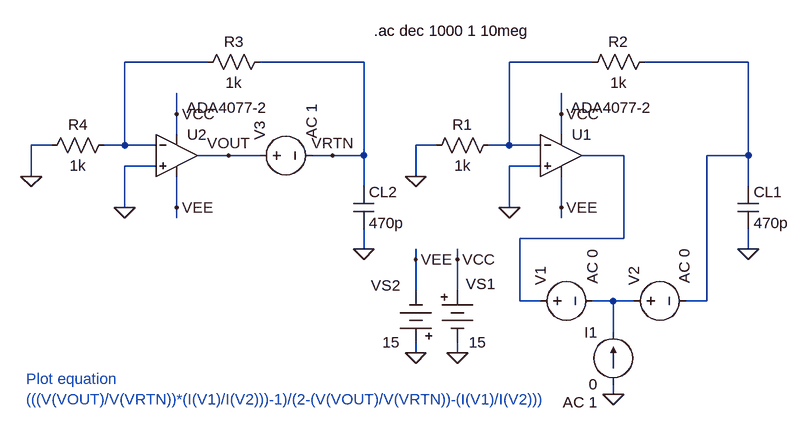
[diagram p0: schematic fig-03-01-31.asc]
fig-03-01-31.asc, the LTspice schematic file:
Version 4
SHEET 1 964 680
WIRE -336 32 -464 32
WIRE -96 32 -256 32
WIRE 256 32 128 32
WIRE 496 32 336 32
WIRE -384 112 -384 80
WIRE 208 112 208 80
WIRE -384 144 -384 112
WIRE 208 144 208 112
WIRE -576 160 -608 160
WIRE -464 160 -464 32
WIRE -464 160 -496 160
WIRE -416 160 -464 160
WIRE 16 160 -16 160
WIRE 128 160 128 32
WIRE 128 160 96 160
WIRE 176 160 128 160
WIRE -304 176 -352 176
WIRE -256 176 -304 176
WIRE -144 176 -176 176
WIRE -96 176 -96 32
WIRE -96 176 -144 176
WIRE 304 176 240 176
WIRE 496 176 496 32
WIRE 496 176 432 176
WIRE -416 192 -464 192
WIRE 176 192 128 192
WIRE -608 208 -608 160
WIRE -16 208 -16 160
WIRE -96 224 -96 176
WIRE 496 224 496 176
WIRE -464 256 -464 192
WIRE -384 256 -384 208
WIRE 128 256 128 192
WIRE 208 256 208 208
WIRE -384 272 -384 256
WIRE 208 272 208 256
WIRE 304 304 304 176
WIRE 304 304 144 304
WIRE -96 320 -96 288
WIRE 496 320 496 288
WIRE -16 336 -16 320
WIRE 48 336 48 320
WIRE -16 384 -16 336
WIRE 48 384 48 336
WIRE 144 400 144 304
WIRE 176 400 144 400
WIRE 288 400 256 400
WIRE 320 400 288 400
WIRE 432 400 432 176
WIRE 432 400 400 400
WIRE 288 448 288 400
WIRE -16 480 -16 464
WIRE 48 480 48 464
WIRE 288 544 288 528
FLAG 128 256 0
FLAG -16 208 0
FLAG -16 480 0
FLAG 48 480 0
FLAG -16 336 VEE
FLAG 48 336 VCC
FLAG 208 112 VCC
FLAG 208 256 VEE
FLAG 496 320 0
FLAG 288 544 0
FLAG -464 256 0
FLAG -608 208 0
FLAG -384 112 VCC
FLAG -384 256 VEE
FLAG -96 320 0
FLAG -304 176 VOUT
FLAG -144 176 VRTN
SYMBOL res 352 16 R90
WINDOW 0 0 56 VBottom 2
WINDOW 3 32 56 VTop 2
SYMATTR InstName R2
SYMATTR Value 1k
SYMBOL Misc\\battery 48 368 R0
WINDOW 0 13 6 Left 2
WINDOW 3 18 96 Left 2
SYMATTR InstName VS1
SYMATTR Value 15
SYMBOL Misc\\battery -16 480 R180
WINDOW 0 24 104 Left 2
WINDOW 3 24 16 Left 2
SYMATTR InstName VS2
SYMATTR Value 15
SYMBOL Opamps\\ADA4077-2 208 112 R0
WINDOW 3 15 -10 Left 2
SYMATTR InstName U1
SYMBOL res 112 144 R90
WINDOW 0 0 56 VBottom 2
WINDOW 3 32 56 VTop 2
SYMATTR InstName R1
SYMATTR Value 1k
SYMBOL cap 480 224 R0
SYMATTR InstName CL1
SYMATTR Value 470p
SYMBOL voltage 160 400 R270
WINDOW 123 26 96 Left 2
WINDOW 39 0 0 Left 0
SYMATTR Value2 AC 0
SYMATTR InstName V1
SYMATTR Value ""
SYMBOL voltage 304 400 R270
WINDOW 123 27 94 Left 2
WINDOW 39 0 0 Left 0
SYMATTR Value2 AC 0
SYMATTR InstName V2
SYMATTR Value ""
SYMBOL current 288 528 R180
WINDOW 0 24 80 Left 2
WINDOW 3 24 0 Left 2
WINDOW 123 24 -28 Left 2
WINDOW 39 0 0 Left 0
SYMATTR InstName I1
SYMATTR Value 0
SYMATTR Value2 AC 1
SYMBOL res -240 16 R90
WINDOW 0 0 56 VBottom 2
WINDOW 3 32 56 VTop 2
SYMATTR InstName R3
SYMATTR Value 1k
SYMBOL Opamps\\ADA4077-2 -384 112 R0
WINDOW 3 15 -10 Left 2
SYMATTR InstName U2
SYMBOL res -480 144 R90
WINDOW 0 0 56 VBottom 2
WINDOW 3 32 56 VTop 2
SYMATTR InstName R4
SYMATTR Value 1k
SYMBOL cap -112 224 R0
SYMATTR InstName CL2
SYMATTR Value 470p
SYMBOL voltage -272 176 R270
WINDOW 123 26 96 Left 2
WINDOW 39 0 0 Left 0
SYMATTR Value2 AC 1
SYMATTR InstName V3
SYMATTR Value ""
TEXT -80 -16 Left 2 !.ac dec 1000 1 10meg
TEXT -616 520 Left 2 ;Plot equation\n(((V(VOUT)/V(VRTN))*(I(V1)/I(V2)))-1)/(2-(V(VOUT)/V(VRTN))-(I(V1)/I(V2)))

The netlist it stands for:
* fig-03-01-31.asc
R2 N003 N002 1k
VS1 VCC 0 15
VS2 0 VEE 15
XU1 0 N002 VCC VEE N004 ADA4077-2  ; pins In+ In- V+ V- OUT
R1 N002 0 1k
CL1 N003 0 470p
V1 N004 N005 AC 0
V2 N005 N003 AC 0
I1 0 N005 0 AC 1
R3 VRTN N001 1k
XU2 0 N001 VCC VEE VOUT ADA4077-2  ; pins In+ In- V+ V- OUT
R4 N001 0 1k
CL2 VRTN 0 470p
V3 VOUT VRTN AC 1
.ac dec 1000 1 10meg
* Plot equation
* (((V(VOUT)/V(VRTN))*(I(V1)/I(V2)))-1)/(2-(V(VOUT)/V(VRTN))-(I(V1)/I(V2)))
.backanno
.end